# EAGLE design keypad (EAGLE 7.6.0)
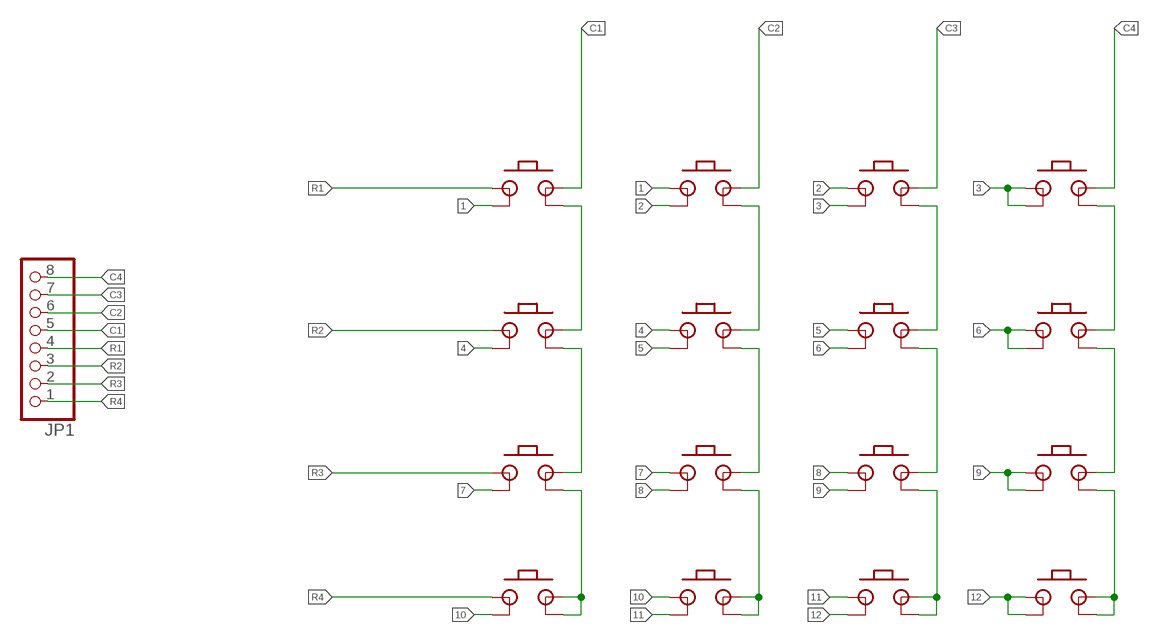
[diagram p0: schematic, sheet 1]

## Parts
JP1  PINHD-1X8  [1X08]
PB1  TACTSW  [TACTSW]
PB2  TACTSW  [TACTSW]
PB3  TACTSW  [TACTSW]
PB4  TACTSW  [TACTSW]
PB5  TACTSW  [TACTSW]
PB6  TACTSW  [TACTSW]
PB7  TACTSW  [TACTSW]
PB8  TACTSW  [TACTSW]
PB9  TACTSW  [TACTSW]
PB10  TACTSW  [TACTSW]
PB11  TACTSW  [TACTSW]
PB12  TACTSW  [TACTSW]
PB13  TACTSW  [TACTSW]
PB14  TACTSW  [TACTSW]
PB15  TACTSW  [TACTSW]
PB16  TACTSW  [TACTSW]

## Nets
1: PB1.P$2 PB2.P$1
2: PB2.P$2 PB3.P$1
3: PB3.P$2 PB4.P$1 PB4.P$2
4: PB5.P$2 PB6.P$1
5: PB6.P$2 PB7.P$1
6: PB7.P$2 PB8.P$1 PB8.P$2
7: PB9.P$2 PB10.P$1
8: PB10.P$2 PB11.P$1
9: PB7.P$4 PB11.P$2 PB11.P$3 PB12.P$1 PB12.P$2
10: PB13.P$2 PB14.P$1
11: PB14.P$2 PB15.P$1
12: PB15.P$2 PB16.P$1 PB16.P$2
C1: JP1.5 PB1.P$3
C2: JP1.6 PB2.P$3
C3: JP1.7 PB3.P$3
C4: JP1.8 PB4.P$3
N$3: PB1.P$4 PB5.P$3
N$4: PB5.P$4 PB9.P$3
N$5: PB9.P$4 PB13.P$3 PB13.P$4
N$8: PB2.P$4 PB6.P$3
N$9: PB6.P$4 PB10.P$3
N$10: PB10.P$4 PB14.P$3 PB14.P$4
N$12: PB3.P$4 PB7.P$3
N$14: PB11.P$4 PB15.P$3 PB15.P$4
N$17: PB4.P$4 PB8.P$3
N$18: PB8.P$4 PB12.P$3
N$19: PB12.P$4 PB16.P$3 PB16.P$4
R1: JP1.4 PB1.P$1
R2: JP1.3 PB5.P$1
R3: JP1.2 PB9.P$1
R4: JP1.1 PB13.P$1

## Library data of the parts
JP1 = pinhead:PINHD-1X8: PIN HEADER
PB1-PB16 = TACTSW:TACTSW

## Board
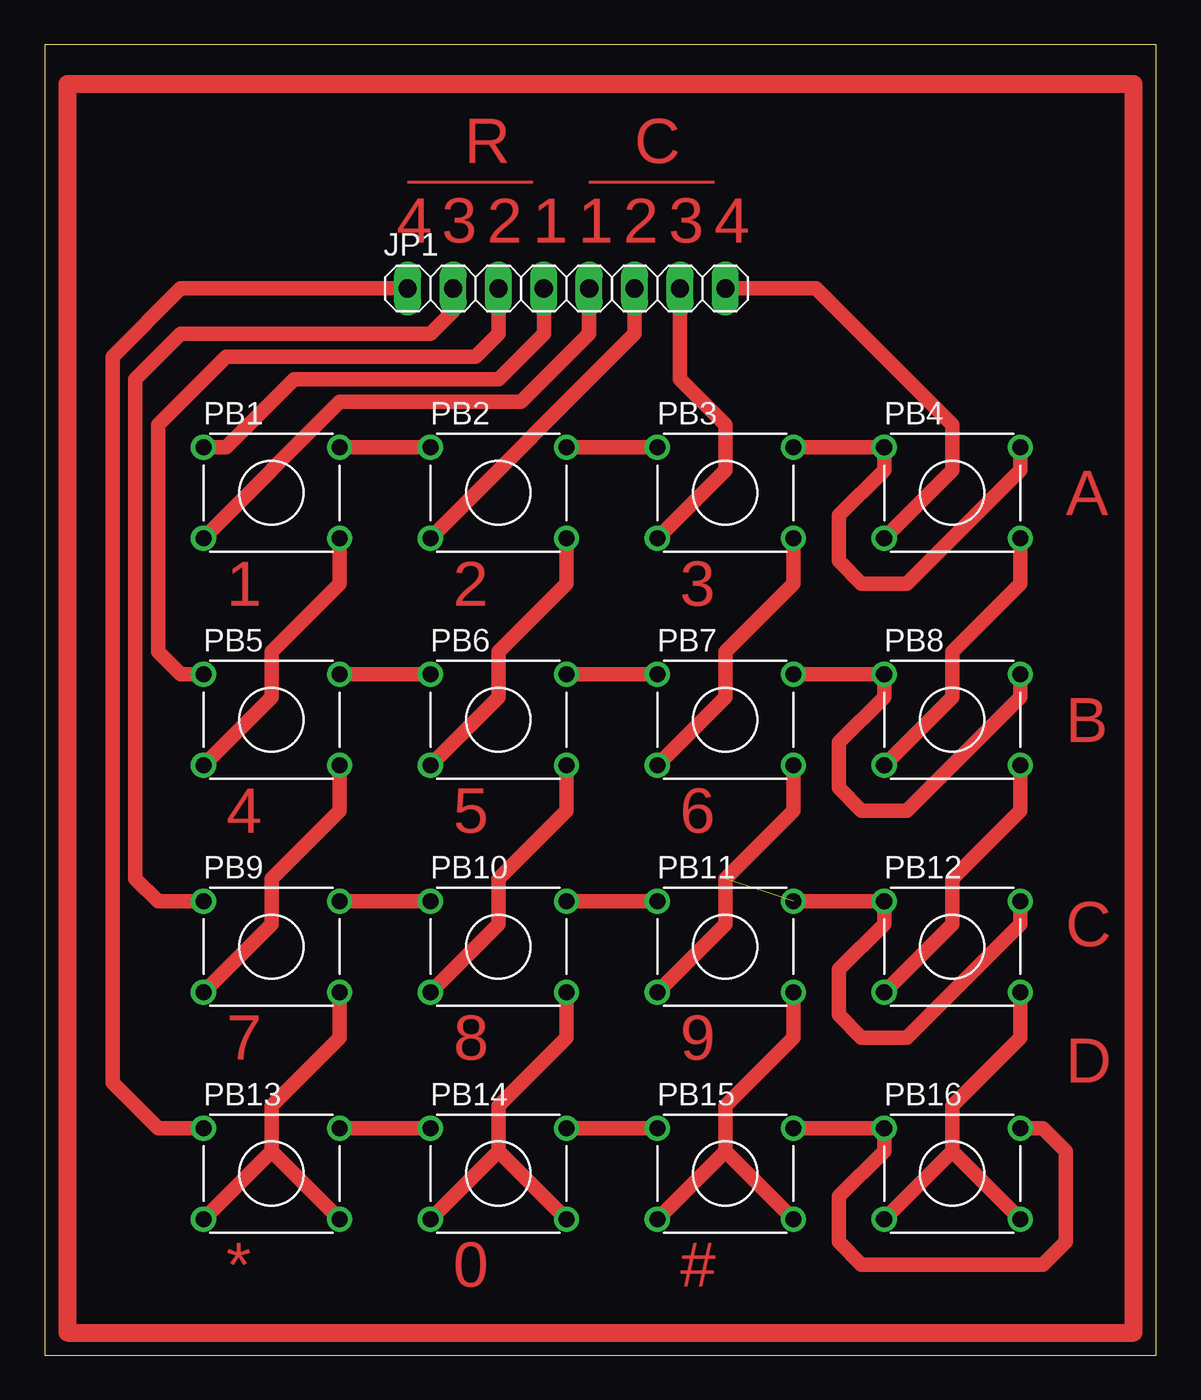
[diagram p1: board, top side]

Size 62.21 x 73.33 mm. Coordinates in mm from the lower left corner, seen from the top.
Outline: 0,0 62.21,0 62.21,73.33 0,73.33 0,0
Copper layers (1*16): Top 0.035mm / dielectric 1.5mm / Bottom 0.035mm
Design rules "default": minimum track width 10mil, minimum drill 24mil, track to track 8mil, track to pad 8mil, pad to pad 8mil, via to via 8mil, smd to smd 8mil, copper to edge 40mil, drill to drill 8mil, minimum pad ring 10mil, minimum via ring 8mil, stop-mask expansion 4mil, vias tented up to drill 0mil, thermal gap 10mil

### Footprints (pad centres in the part's own frame; a part is rotated, then mirrored left to right if it is on the bottom)
1X08 = drill 1.016 long: 1 -8.89,0; 2 -6.35,0; 3 -3.81,0; 4 -1.27,0; 5 1.27,0; 6 3.81,0; 7 6.35,0; 8 8.89,0
TACTSW = drill 0.9: P$1 -3.81,2.54; P$2 3.81,2.54; P$3 -3.81,-2.54; P$4 3.81,-2.54

### Placement (x,y rotation side)
JP1  29.21,59.69 0 top
PB1  12.7,48.26 0 top
PB2  25.4,48.26 0 top
PB3  38.1,48.26 0 top
PB4  50.8,48.26 0 top
PB5  12.7,35.56 0 top
PB6  25.4,35.56 0 top
PB7  38.1,35.56 0 top
PB8  50.8,35.56 0 top
PB9  12.7,22.86 0 top
PB10  25.4,22.86 0 top
PB11  38.1,22.86 0 top
PB12  50.8,22.86 0 top
PB13  12.7,10.16 0 top
PB14  25.4,10.16 0 top
PB15  38.1,10.16 0 top
PB16  50.8,10.16 0 top

### Tracks (layer width: path | path; a pad name or v marks a point on that pad's centre or on a via)
1
  Top 0.813: PB1.P$2 PB2.P$1
2
  Top 0.813: PB2.P$2 PB3.P$1
3
  Top 0.813: PB3.P$2 PB4.P$1 46.99,49.53 44.45,46.99 44.45,44.45 45.72,43.18 48.26,43.18 54.61,49.53 PB4.P$2
4
  Top 0.813: PB5.P$2 PB6.P$1
5
  Top 0.813: PB6.P$2 PB7.P$1
6
  Top 0.813: PB8.P$2 54.61,36.83 48.26,30.48 45.72,30.48 44.45,31.75 44.45,34.29 46.99,36.83 PB8.P$1 PB7.P$2
7
  Top 0.813: PB9.P$2 PB10.P$1
8
  Top 0.813: PB11.P$1 PB10.P$2
9  (1 unrouted)
  Top 0.813: PB7.P$4 41.91,30.48 38.1,26.67 38.1,24.13 PB11.P$3 | PB12.P$2 54.61,24.13 48.26,17.78 45.72,17.78 44.45,19.05 44.45,21.59 46.99,24.13 PB12.P$1 PB11.P$2
10
  Top 0.813: PB13.P$2 PB14.P$1
11
  Top 0.813: PB15.P$1 PB14.P$2
12
  Top 0.813: PB16.P$2 55.88,12.7 57.15,11.43 57.15,6.35 55.88,5.08 45.72,5.08 44.45,6.35 44.45,8.89 46.99,11.43 PB16.P$1 PB15.P$2
C1
  Top 0.813: JP1.5 30.48,57.15 26.67,53.34 16.51,53.34 PB1.P$3
C2
  Top 0.813: JP1.6 33.02,57.15 PB2.P$3
C3
  Top 0.813: JP1.7 35.56,54.61 38.1,52.07 38.1,49.53 PB3.P$3
C4
  Top 0.813: JP1.8 43.18,59.69 50.8,52.07 50.8,49.53 PB4.P$3
N$1
  Top 1.016: 1.27,71.12 1.27,1.27 60.96,1.27 60.96,71.12 1.27,71.12
N$3
  Top 0.813: PB1.P$4 16.51,43.18 12.7,39.37 12.7,36.83 PB5.P$3
N$4
  Top 0.813: PB5.P$4 16.51,30.48 12.7,26.67 12.7,24.13 PB9.P$3
N$5
  Top 0.813: PB9.P$4 16.51,17.78 12.7,13.97 12.7,11.43 | 12.7,11.43 PB13.P$3 | 12.7,11.43 PB13.P$4
N$8
  Top 0.813: PB2.P$4 29.21,43.18 25.4,39.37 25.4,36.83 PB6.P$3
N$9
  Top 0.813: PB6.P$4 29.21,30.48 25.4,26.67 25.4,24.13 PB10.P$3
N$10
  Top 0.813: PB10.P$4 29.21,17.78 25.4,13.97 25.4,11.43 | 25.4,11.43 PB14.P$3 | 25.4,11.43 PB14.P$4
N$12
  Top 0.813: PB3.P$4 41.91,43.18 38.1,39.37 38.1,36.83 PB7.P$3
N$14
  Top 0.813: 38.1,11.43 38.1,13.97 41.91,17.78 PB11.P$4 | 38.1,11.43 PB15.P$3 | 38.1,11.43 PB15.P$4
N$17
  Top 0.813: PB4.P$4 54.61,43.18 50.8,39.37 50.8,36.83 PB8.P$3
N$18
  Top 0.813: PB8.P$4 54.61,30.48 50.8,26.67 50.8,24.13 PB12.P$3
N$19
  Top 0.813: PB12.P$4 54.61,17.78 50.8,13.97 50.8,11.43 | 50.8,11.43 PB16.P$3 | 50.8,11.43 PB16.P$4
R1
  Top 0.813: PB1.P$1 10.16,50.8 13.97,54.61 25.4,54.61 27.94,57.15 JP1.4
R2
  Top 0.813: PB5.P$1 7.62,38.1 6.35,39.37 6.35,52.07 10.16,55.88 24.13,55.88 25.4,57.15 JP1.3
R3
  Top 0.813: PB9.P$1 6.35,25.4 5.08,26.67 5.08,54.61 7.62,57.15 21.59,57.15 22.86,58.42 JP1.2
R4
  Top 0.813: PB13.P$1 6.35,12.7 3.81,15.24 3.81,55.88 7.62,59.69 JP1.1

### Text on the board
Top: R | C | _____ | _____ | 4 | 3 | 2 | 1 | 1 | 2 | 3 | 4 | A | 1 | 2 | 3 | B | 4 | 5 | 6 | C | 7 | 8 | 9 | D | * | 0 | #